# Altium schematic sheet Power.SchDoc
size A4
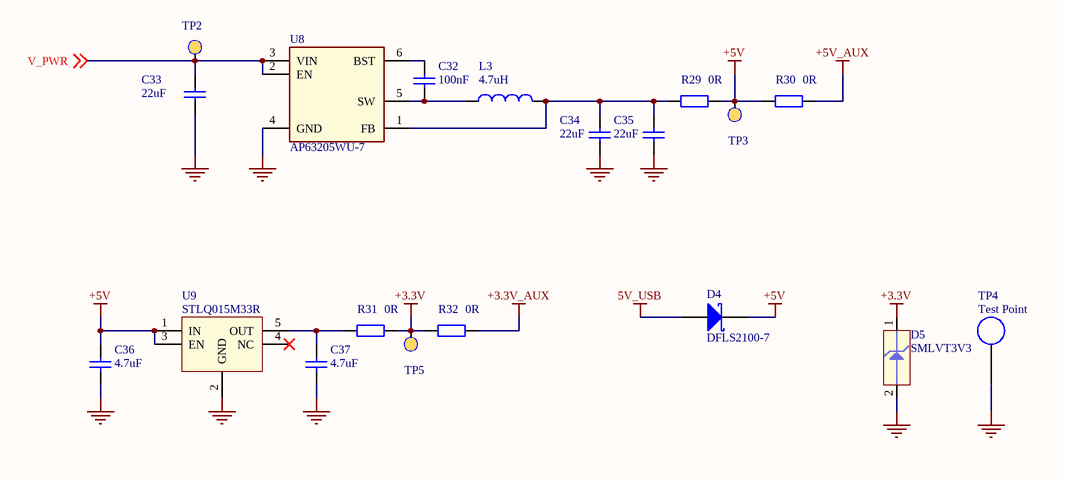
[diagram p0: Power.SchDoc]

## Parts
C32  value 100nF  [C0402]  (hidden comment: Capacitor ceramic)
C33  value 22uF  [C1210]  (hidden comment: Capacitor ceramic)
C34  value 22uF  [C1210]  (hidden comment: Capacitor ceramic)
C35  value 22uF  [C1210]  (hidden comment: Capacitor ceramic)
C36  value 4.7uF  [C0805]  (hidden comment: Capacitor ceramic)
C37  value 4.7uF  [C0805]  (hidden comment: Capacitor ceramic)
D4  DFLS2100-7  [PowerDI123]
D5  SMLVT3V3  [DO-214AA]
L3  value 4.7uH  [LQH3NP]  (hidden comment: Power Inductor)
R29  value 0R  [R1206]  (hidden comment: Resistor)
R30  value 0R  [R1206]  (hidden comment: Resistor)
R31  value 0R  [R1206]  (hidden comment: Resistor)
R32  value 0R  [R1206]  (hidden comment: Resistor)
TP2  Test_Point  [TEST_POINT]  (value not drawn)  (no BOM)
TP3  Test_Point  [TEST_POINT]  (value not drawn)  (no BOM)
TP4  Test Point  [5019_keystone]
TP5  Test_Point  [TEST_POINT]  (value not drawn)  (no BOM)
U8  AP63205WU-7  [SOT23-6_custom]
U9  STLQ015M33R  [SOT23-5L]

## Nets
5V_USB: D4.1(A)
+3.3V: D5.1(PIN1) R31.1 R32.2 TP5.0
+3.3V_AUX: R32.1
+5V: C36.2 D4.2(K) R29.1 R30.2 TP3.0 U9.1(IN) U9.3(EN)
+5V_AUX: R30.1
GND: C33.1 C34.1 C35.1 C36.1 C37.1 D5.2(PIN2) TP4.1 U8.4(GND) U9.2(GND)
V_PWR: C33.2 TP2.0 U8.2(EN) U8.3(VIN) ; off-sheet V_PWR
NetC32_1: C32.1 L3.1 U8.5(SW)
NetC32_2: C32.2 U8.6(BST)
NetC34_2: C34.2 C35.2 L3.2 R29.2 U8.1(FB)
NetC37_2: C37.2 R31.2 U9.5(OUT)

Not connected (* = marked no-connect by the designer): U9 4(NC)*

## Library data of the parts
C32 = Cap Semi: Manufacturer: TDK Corporation; Manufacturer Part No.: CGA2B3X7R1V104K050BB; Part Description: Ceramic Capacitor; Specification: X7R, 35V, 10%; Supplier: DigiKey; Supplier part number: 445-6901-1-ND; Link: https://www.digikey.com/product-detail/en/tdk-corporation/CGA2B3X7R1V104K050BB/445-6901-1-ND/2672919
C33-C35 = Cap Semi: Manufacturer: Taiyo Yuden; Manufacturer Part No.: GMK325BJ226MM-P; Part Description: Ceramic Capacitor; Specification: X5R, 35V, 20%; Supplier: DigiKey; Supplier part number: 587-5853-1-ND; Link: https://www.digikey.com/product-detail/en/taiyo-yuden/GMK325BJ226MM-P/587-5853-1-ND/7674973
C36 C37 = Cap Semi: Manufacturer: Murata Electronics; Manufacturer Part No.: GRM219R6YA475KA73D; Part Description: Ceramic Capacitor; Specification: X5R, 35V, 10%; Supplier: DigiKey; Supplier part number: 490-7208-1-ND; Link: https://www.digikey.com/product-detail/en/murata-electronics/GRM219R6YA475KA73D/490-7208-1-ND/3900454
D4 = D Schottky: Schottky Diode; Manufacturer: Diodes Incorporated; Part Description: DIODE SCHOTTKY; Specification: 100V, 2A; Link: https://www.digikey.com/product-detail/en/diodes-incorporated/DFLS2100-7/DFLS2100-7DICT-ND/3451552; Value: DFLS2100-7; Manufacturer Part No.: DFLS2100-7; Supplier: DigiKey; Supplier part number: DFLS2100-7DICT-ND
D5 = ESD_Diode: ESD Diode Symbol; Manufacturer: STMicroelectronics; Part Description: Low voltage Transil™; Specification: 3.3V, 0.6kW; Link: https://www.digikey.com/product-detail/en/stmicroelectronics/SMLVT3V3/497-2496-1-ND/603878; Manufacturer Part No.: SMLVT3V3; Supplier: DigiKey; Supplier part number: 497-2496-1-ND; Value: SMLVT3V3
L3 = Inductor: Manufacturer: Murata Electronics; Manufacturer Part No.: LQH3NPN4R7MMEL; Specification: 1A, 20%; Supplier: DigiKey; Supplier part number: 490-15954-1-ND; Part Description: Power Inductor; Link: https://www.digikey.com/product-detail/en/murata-electronics/LQH3NPN4R7MMEL/490-15954-1-ND/6800619
R29-R32 = Res2: Manufacturer: Yageo; Manufacturer Part No.: RC1206JR-070RL; Part Description: Thick Film Resistor; Specification: 0.25W; Supplier: DigiKey; Supplier part number: 311-0.0ERDKR-ND; Link: https://www.digikey.com/product-detail/en/yageo/RC1206JR-070RL/311-0-0ERDKR-ND/735078
TP2 TP3 TP5 = Test_Point: Test Point
TP4 = 5019: SMD Test Point; Manufacturer: Keystone Electronics; Part Description: SMT Test Point; Specification: 3.81*2.03; Value: 5019; Manufacturer Part No.: 5019; Supplier: DigiKey; Supplier part number: 36-5019CT-ND; Link: https://www.digikey.com/product-detail/en/keystone-electronics/5019/36-5019CT-ND/3907344
U8 = AP63205WU-7: SYNCHRONOUS BUCK WITH ENHANCED EMI REDUCTION; Manufacturer: Diodes Incorporated; Part Description: Buck Switching Regulator; Specification: 32V in, 5V, 2A; Link: https://www.digikey.com/product-detail/en/diodes-incorporated/AP63205WU-7/AP63205WU-7DICT-ND/9858428; Manufacturer Part No.: AP63205WU-7; Supplier: DigiKey; Supplier part number: AP63205WU-7DICT-ND; Value: AP63205WU-7
U9 = STLQ015M33R: Ultra low quiescent current linear voltage regulator; Manufacturer: STMicroelectronics; Specification: 5.5V in, 3.3V, 150mA; Link: https://www.digikey.com/product-detail/en/stmicroelectronics/STLQ015M33R/497-15934-1-ND/5398723; Manufacturer Part No.: STLQ015M33R; Part Description: Linear Voltage Regulator; Supplier: DigiKey; Supplier part number: 497-15934-1-ND; Value: STLQ015M33R